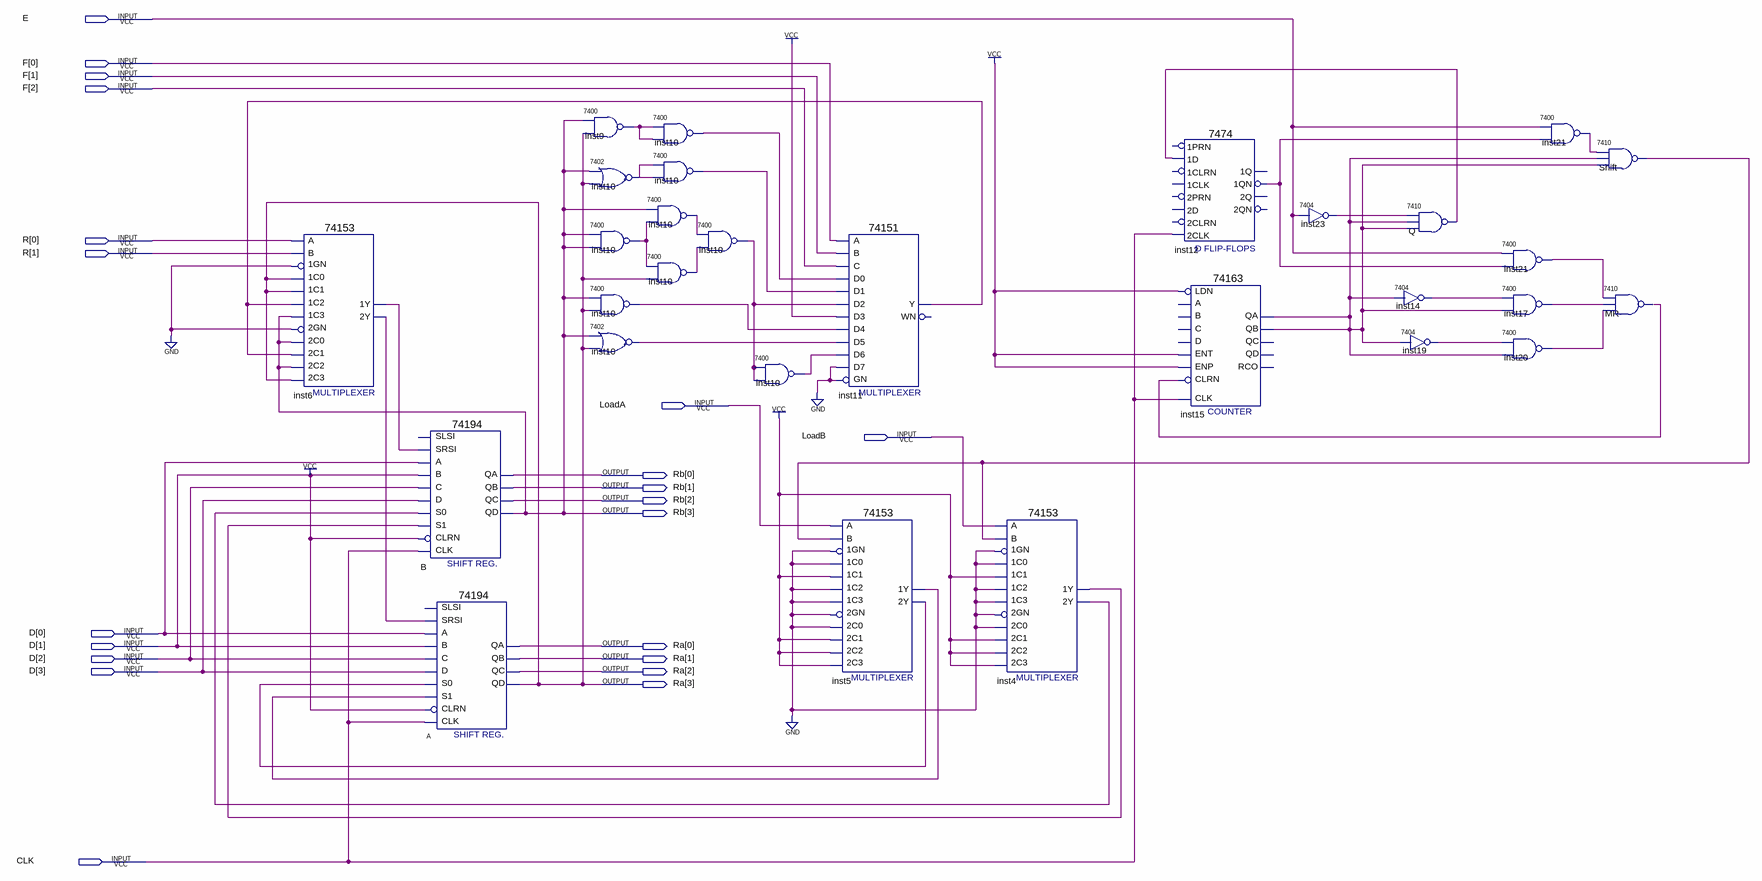
[diagram p0: schematic sheet]
// Quartus schematic Lab21.bdf as structural Verilog: 29 symbols, 21 pins
module Lab21 (
  input  E,
  input  [2:0] F,
  input  [1:0] R,
  input  LoadA,
  input  LoadB,
  input  [3:0] D,
  input  CLK,
  output [3:0] Rb,
  output [3:0] Ra
);

  wire inst4_1y, inst4_2y, inst5_1y, inst5_2y, inst6_1y, inst6_2y, inst9_1, inst10_1, inst10_1_2, inst10_1_3,
       inst10_1_4, inst10_1_5, inst10_1_6, inst10_1_7, inst10_1_8, inst10_1_9, inst10_1_10, inst11_y,
       inst12_1qn, inst14_1, inst15_qa, inst17_1, inst19_1, inst20_1, inst21_1, inst21_1_2, inst23_1, MR__1,
       Q_1, Shift_1;

  \74153  inst6 (
    .\1C1 (Ra[3]), .\1GN (1'b0), .\1C0 (Ra[3]), .\2C0 (Rb[3]), .\2GN (1'b0), .\2C2 (Rb[3]), .\1C2 (inst11_y),
    .\1C3 (Rb[3]), .B(R[1]), .A(R[0]), .\2C1 (inst11_y), .\2C3 (Ra[3]), .\1Y (inst6_1y), .\2Y (inst6_2y));
  \74194  B (
    .SRSI(inst6_1y), .B(D[1]), .C(D[2]), .CLK(CLK), .CLRN(D[1]), .D(D[3]), .S1(inst4_1y), .S0(inst4_2y),
    .A(D[0]), .QA(Rb[0]), .QB(Rb[1]), .QC(Rb[2]), .QD(Rb[3]));  // open: SLSI
  \74194  A (
    .SRSI(inst6_2y), .B(D[1]), .C(D[2]), .CLK(CLK), .CLRN(D[1]), .D(D[3]), .S1(inst5_1y), .S0(inst5_2y),
    .A(D[0]), .QA(Ra[0]), .QB(Ra[1]), .QC(Ra[2]), .QD(Ra[3]));  // open: SLSI
  \7400  inst9 (.\3 (Ra[3]), .\2 (Rb[3]), .\1 (inst9_1));
  \7402  inst10 (.\2 (Rb[3]), .\3 (Ra[3]), .\1 (inst10_1_2));
  \7400  inst10_dup2 (.\3 (Rb[3]), .\2 (Rb[3]), .\1 (inst10_1_4));
  \7400  inst10_dup3 (.\3 (Ra[3]), .\2 (Rb[3]), .\1 (inst10_1_8));
  \7402  inst10_dup4 (.\2 (Rb[3]), .\3 (Ra[3]), .\1 (inst10_1_9));
  \7400  inst10_dup5 (.\3 (inst9_1), .\2 (inst9_1), .\1 (inst10_1));
  \7400  inst10_dup6 (.\3 (inst10_1_2), .\2 (inst10_1_2), .\1 (inst10_1_3));
  \7400  inst10_dup7 (.\3 (inst10_1_4), .\2 (Rb[3]), .\1 (inst10_1_5));
  \7400  inst10_dup8 (.\3 (Ra[3]), .\2 (inst10_1_4), .\1 (inst10_1_6));
  \7400  inst10_dup9 (.\3 (inst10_1_6), .\2 (inst10_1_5), .\1 (inst10_1_7));
  \7400  inst10_dup10 (.\3 (inst10_1_7), .\2 (inst10_1_7), .\1 (inst10_1_10));
  \74151  inst11 (
    .GN(1'b0), .C(F[2]), .B(F[1]), .A(F[0]), .D5(inst10_1_9), .D0(inst10_1), .D1(inst10_1_3),
    .D4(inst10_1_8), .D3(1'b1), .D2(inst10_1_7), .D6(inst10_1_10), .D7(1'b0), .Y(inst11_y));  // open: WN
  \74153  inst5 (
    .\1C1 (1'b1), .\1GN (1'b0), .\1C0 (1'b0), .\2C0 (1'b0), .\2GN (1'b0), .\2C2 (1'b1), .\1C2 (1'b0),
    .\1C3 (1'b0), .B(Shift_1), .A(LoadA), .\2C1 (1'b1), .\2C3 (1'b1), .\1Y (inst5_1y), .\2Y (inst5_2y));
  \74153  inst4 (
    .\1C1 (1'b1), .\1GN (1'b0), .\1C0 (1'b0), .\2C0 (1'b0), .\2GN (1'b0), .\2C2 (1'b1), .\1C2 (1'b0),
    .\1C3 (1'b0), .B(Shift_1), .A(LoadB), .\2C1 (1'b1), .\2C3 (1'b1), .\1Y (inst4_1y), .\2Y (inst4_2y));
  \7474  inst12 (
    .\1D (Q_1), .\2CLK (CLK), .\1QN (inst12_1qn));  // open: 2D, 2PRN, 1CLK, 1PRN, 2CLRN, 1CLRN, 2Q, 2QN, 1Q
  \74163  inst15 (
    .ENT(1'b1), .CLRN(MR__1), .CLK(CLK), .ENP(1'b1), .LDN(1'b1), .QA(inst15_qa), .QB(inst15_qa));  // open: C, B, A, D, QC, QD, RCO
  \7404  inst23 (.\2 (E), .\1 (inst23_1));
  \7410  Q (.\2 (inst23_1), .\3 (inst15_qa), .\4 (inst15_qa), .\1 (Q_1));
  \7404  inst14 (.\2 (inst15_qa), .\1 (inst14_1));
  \7404  inst19 (.\2 (inst15_qa), .\1 (inst19_1));
  \7400  inst21 (.\3 (inst12_1qn), .\2 (E), .\1 (inst21_1));
  \7400  inst17 (.\3 (inst15_qa), .\2 (inst14_1), .\1 (inst17_1));
  \7400  inst20 (.\3 (inst15_qa), .\2 (inst19_1), .\1 (inst20_1));
  \7400  inst21_dup2 (.\3 (inst12_1qn), .\2 (E), .\1 (inst21_1_2));
  \7410  Shift (.\2 (inst21_1_2), .\3 (inst15_qa), .\4 (inst15_qa), .\1 (Shift_1));
  \7410  \MR-  (.\2 (inst21_1), .\3 (inst17_1), .\4 (inst20_1), .\1 (MR__1));
  // also tied to VCC on the sheet: D[1]
endmodule
